# EAGLE design LiPoDisp_td (EAGLE 5.09)
BEST: Farnell 1754066
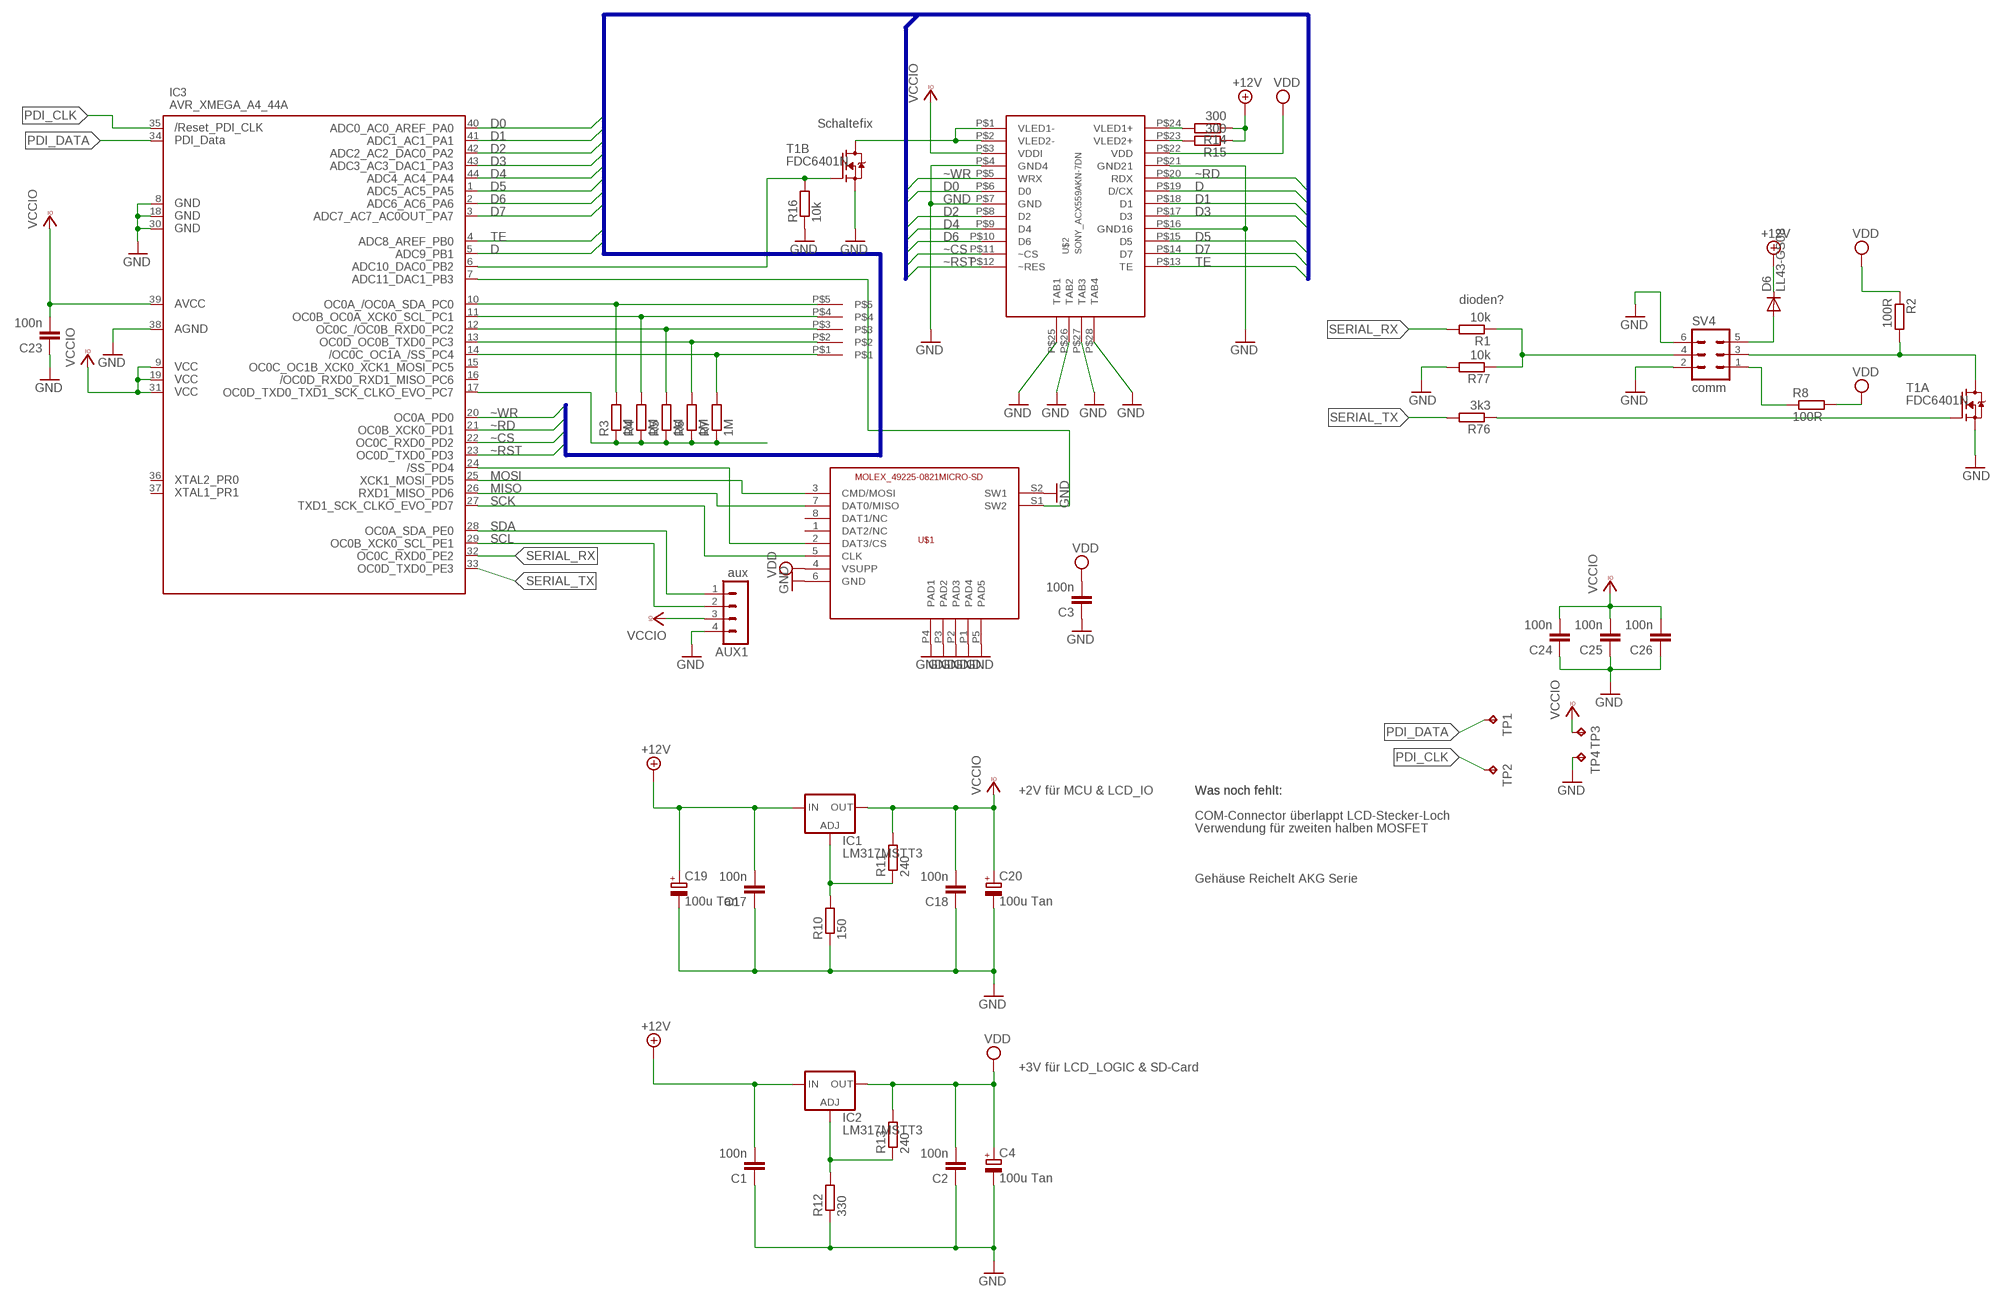
[diagram p0: schematic, sheet 1]

## Parts
AUX1  aux  MA04-1  [MA04-1]
C1  100n  C-EUC0603K  [C0603K]
C2  100n  C-EUC0603K  [C0603K]
C3  100n  C-EUC0603K  [C0603K]
C4  100u Tan  CPOL-EUSMCC  [SMC_C]
C17  100n  C-EUC0603K  [C0603K]
C18  100n  C-EUC0603K  [C0603K]
C19  100u Tan  CPOL-EUSMCC  [SMC_C]
C20  100u Tan  CPOL-EUSMCC  [SMC_C]
C23  100n  C-EUC0603K  [C0603K]
C24  100n  C-EUC0603K  [C0603K]
C25  100n  C-EUC0603K  [C0603K]
C26  100n  C-EUC0603K  [C0603K]
D6  LL43-GS08  DIODE-SOD80C  [SOD80C]
IC1  LM317MSTT3  [SOT223]
IC2  LM317MSTT3  [SOT223]
IC3  AVR_XMEGA_A4_44A  [TQFP44]
P3  PAD5V  [PAD5V]
R1  10k  R-EU_R0603  [R0603]
R2  100R  R-EU_R1206  [R1206]
R3  1M  R-EU_R0603  [R0603]
R4  1M  R-EU_R0603  [R0603]
R5  1M  R-EU_R0603  [R0603]
R6  1M  R-EU_R0603  [R0603]
R7  1M  R-EU_R0603  [R0603]
R8  100R  R-EU_R1206  [R1206]
R10  150  R-EU_R0603  [R0603]
R11  240  R-EU_R0603  [R0603]
R12  330  R-EU_R0603  [R0603]
R13  240  R-EU_R0603  [R0603]
R14  300  R-EU_R0603  [R0603]
R15  300  R-EU_R0603  [R0603]
R16  10k  R-EU_R0603  [R0603]
R76  3k3  R-EU_R0603  [R0603]
R77  10k  R-EU_R0603  [R0603]
SV4  comm  ML6L  [ML6L]
T1  FDC6401N  [SUPERSOT-6]
TP1  TPTP15R  [TP15R]
TP2  TPTP15R  [TP15R]
TP3  TPTP15R  [TP15R]
TP4  TPTP15R  [TP15R]
U$1  MOLEX_49225-0821MICRO-SD  [MOLEX_49225-0821MICRO-SD]
U$2  SONY_ACX559AKN-7DN  [SONY_ACX559AKN-7_A]

## Nets
+12V [Lo-Power]: C1.2 C17.2 C19.+ D6.C IC1.3(IN) IC2.3(IN) R14.1 R15.1
D: IC3.5(PB1) U$2.P$19(D/CX)
D0: IC3.40(PA0) U$2.P$6(D0)
D1: IC3.41(PA1) U$2.P$18(D1)
D2: IC3.42(PA2) U$2.P$8(D2)
D3: IC3.43(PA3) U$2.P$17(D3)
D4: IC3.44(PA4) U$2.P$9(D4)
D5: IC3.1(PA5) U$2.P$15(D5)
D6: IC3.2(PA6) U$2.P$10(D6)
D7: IC3.3(PA7) U$2.P$14(D7)
GND [Lo-Power]: AUX1.4 C1.1 C2.1 C3.1 C4.- C17.1 C18.1 C19.- C20.- C23.1 C24.1 C25.1 C26.1 IC3.8(GND1) IC3.18(GND2) IC3.30(GND3) IC3.38(AGND) R10.1 R12.1 R16.1 R77.2 SV4.2 SV4.6 T1.P$2(B:S) T1.P$5(A:S) TP4.TP U$1.6(GND) U$1.P1(PAD4) U$1.P2(PAD3) U$1.P3(PAD2) U$1.P4(PAD1) U$1.P5(PAD5) U$1.S2(SW1) U$2.P$4(GND4) U$2.P$7(GND) U$2.P$16(GND16) U$2.P$21(GND21) U$2.P$25(TAB1) U$2.P$26(TAB2) U$2.P$27(TAB3) U$2.P$28(TAB4)
MISO: IC3.26(PD6) U$1.7(DAT0/MISO)
MOSI: IC3.25(PD5) U$1.3(CMD/MOSI)
N$1: IC3.7(PB3) U$1.S1(SW2)
N$2 [Lo-Power]: R8.1 SV4.1
N$3: R2.2 SV4.3 T1.P$6(A:D)
N$5: IC3.10(PC0) P3.P$5 R3.2
N$6: IC3.11(PC1) P3.P$4 R4.2
N$7: IC3.12(PC2) P3.P$3 R5.2
N$8: IC3.13(PC3) P3.P$2 R6.2
N$9: IC3.14(PC4) P3.P$1 R7.2
N$10: R76.1 T1.P$1(A:G)
N$13: IC3.17(PC7) R3.1 R4.1 R5.1 R6.1 R7.1
N$14: IC3.24(PD4) U$1.2(DAT3/CS)
N$15: IC1.1(ADJ) R10.2 R11.1
N$16: IC2.1(ADJ) R12.2 R13.1
N$17: T1.P$4(B:D) U$2.P$1(VLED1-) U$2.P$2(VLED2-)
N$18: IC3.6(PB2) R16.2 T1.P$3(B:G)
N$19: R14.2 U$2.P$24(VLED1+)
N$20: R15.2 U$2.P$23(VLED2+)
N$84 [Lo-Power]: D6.A SV4.5
PDI_CLK: IC3.35(RESET) TP2.TP
PDI_DATA: IC3.34(PDI_DATA) TP1.TP
SCK: IC3.27(PD7) U$1.5(CLK)
SCL: AUX1.2 IC3.29(PE1)
SDA: AUX1.1 IC3.28(PE0)
SERIAL_RX: IC3.32(PE2) R1.2
SERIAL_RX_R: R1.1 R77.1 SV4.4
SERIAL_TX: IC3.33(PE3) R76.2
TE: IC3.4(PB0) U$2.P$13(TE)
VCCIO [Lo-Power]: AUX1.3 C18.2 C20.+ C23.2 C24.2 C25.2 C26.2 IC1.4(OUT) IC3.9(VCC1) IC3.19(VCC2) IC3.31(VCC3) IC3.39(AVCC) R11.2 TP3.TP U$2.P$3(VDDI)
VDD [Lo-Power]: C2.2 C3.2 C4.+ IC2.4(OUT) R2.1 R8.2 R13.2 U$1.4(VSUPP) U$2.P$22(VDD)
~CS: IC3.22(PD2) U$2.P$11(~CS)
~RD: IC3.21(PD1) U$2.P$20(RDX)
~RST: IC3.23(PD3) U$2.P$12(~RES)
~WR: IC3.20(PD0) U$2.P$5(WRX)
Unconnected: IC3.15(PC5) IC3.16(PC6) IC3.36(PR0) IC3.37(PR1) U$1.1(DAT2/NC) U$1.8(DAT1/NC)

## Buses
D[0..7],~WR,~RD,~CS,~RST,D,TE

## Notes on the sheet
- Schaltefix
- dioden?
- +2V für MCU & LCD_IO | Was noch fehlt: | Was noch fehlt:
- COM-Connector überlappt LCD-Stecker-Loch
- Verwendung für zweiten halben MOSFET
- Gehäuse Reichelt AKG Serie
- +3V für LCD_LOGIC & SD-Card

## Library data of the parts
AUX1 = Fabian:MA04-1: PIN HEADER
C1-C3 C17 C18 C23-C26 = rcl:C-EU: CAPACITOR, European symbol
C4 C19 C20 = rcl:CPOL-EU: POLARIZED CAPACITOR, European symbol
D6 = diode:DIODE-: DIODE
IC1 IC2 = v-reg:LM317?*: 500 mA Adjustable Output Positive Voltage Regulator Source: http://www.onsemi.co.jp .. LM317M-D.PDF
IC3 = xmega:AVR_XMEGA_A4_: Device for Atmel AVR XMEGA A4 Series
P3 = Fabian:PAD5
R1-R8 R10-R16 R76 R77 = rcl:R-EU_: RESISTOR, European symbol
SV4 = con-harting-ml:ML6: HARTING
T1 = Fabian:FDC6401N: dual n mosfet; BEST: Farnell 1467966
TP1-TP4 = testpad:TP: Test pad
U$1 = Fabian:MOLEX_49225-0821MICRO-SD: MOLEX_49225-0821MICRO-SD
U$2 = Fabian:SONY_ACX559AKN-7: SONY ACX559AKN-7 full Color display matching connector JST-JAN 24R-JANK-GSAN-TF

## Net classes
1 Hi-Power: width 0.2 mm
2 Lo-Power: width 0.2 mm

## Board
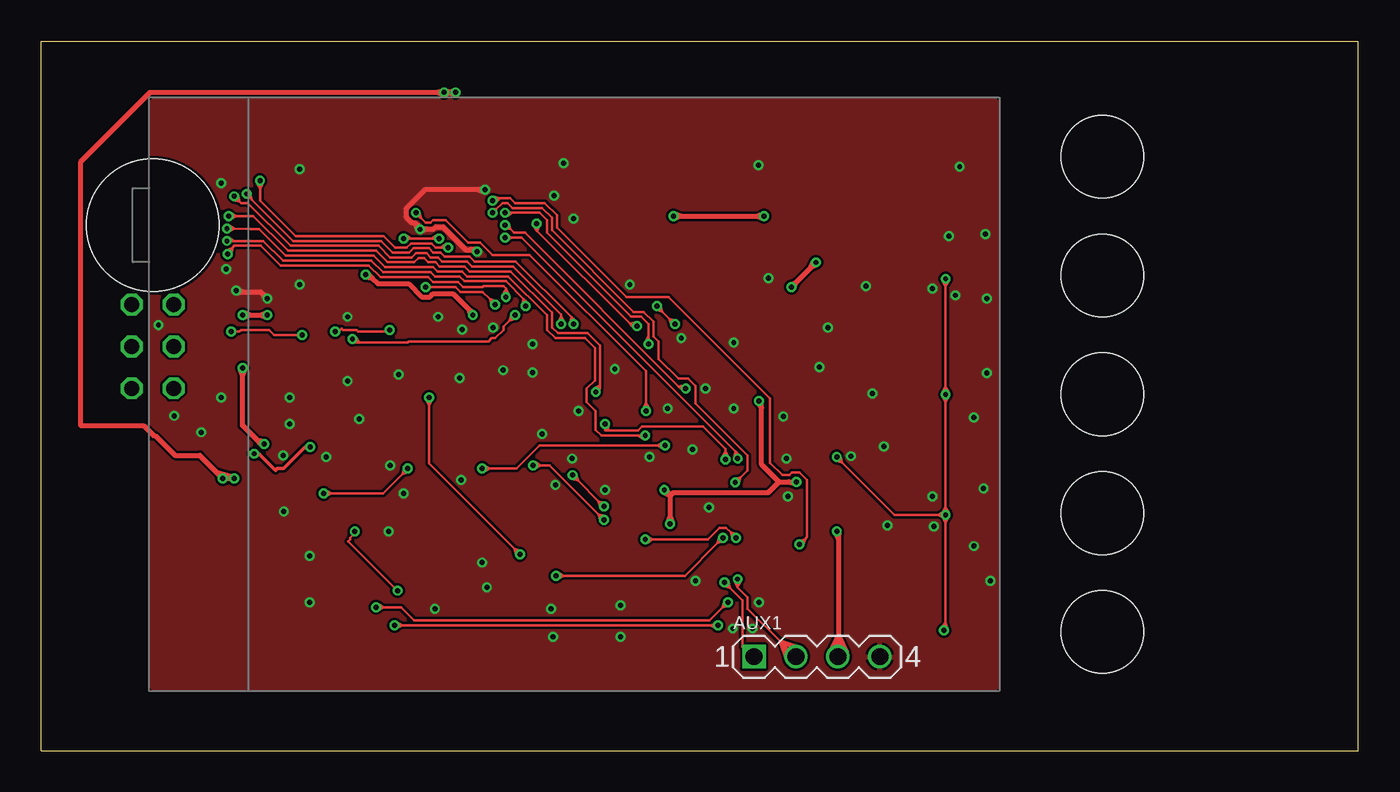
[diagram p1: board, top side]
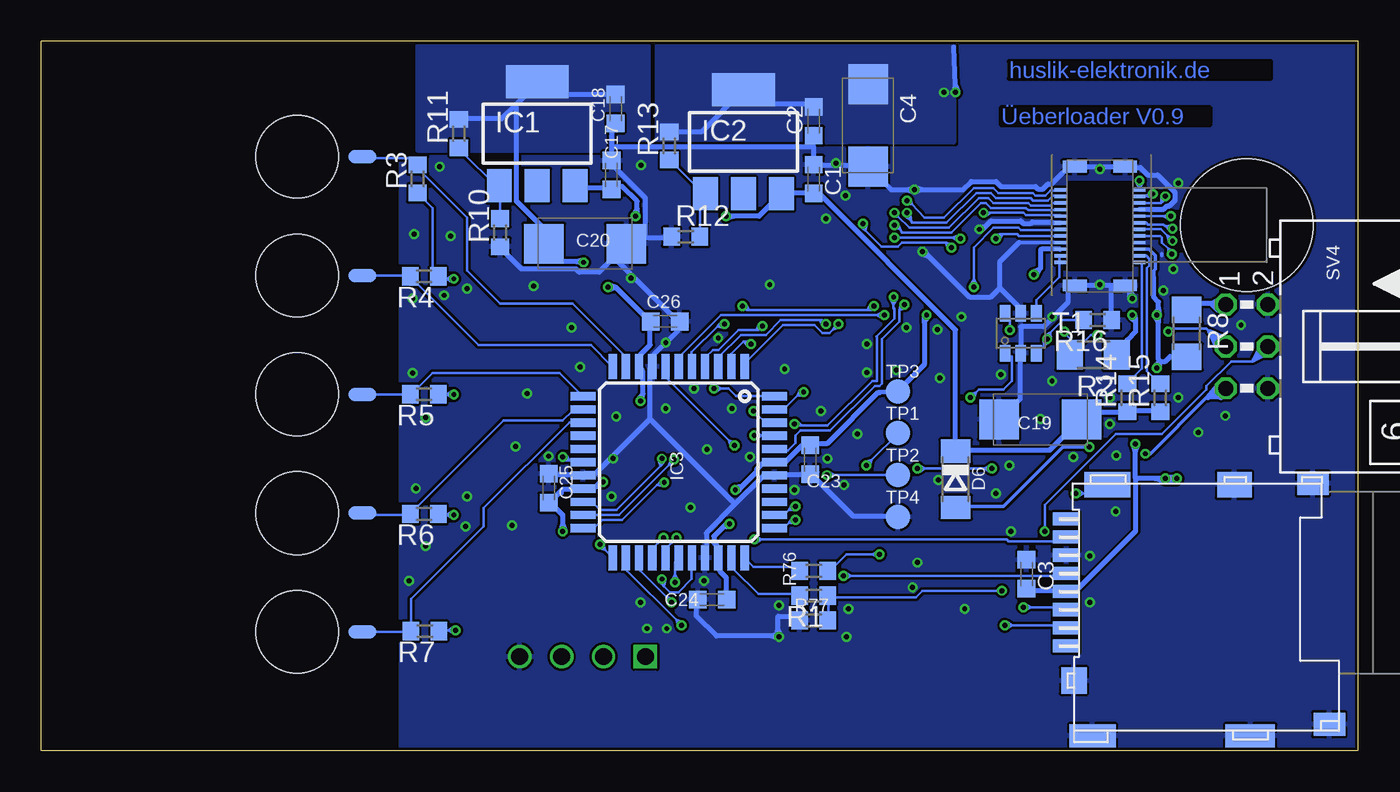
[diagram p2: board, bottom side, seen from below]

Size 79.8 x 43 mm. Coordinates in mm from the lower left corner, seen from the top.
Outline: 0,0 79.8,0 79.8,43 0,43 0,0
Copper layers (1*16): Top 0.035mm / dielectric 1.5mm / Bottom 0.035mm
Design rules "Fischer-LP *": minimum track width 0.15mm, minimum drill 0.3mm, track to track 0.15mm, track to pad 0.15mm, pad to pad 0.15mm, via to via 0.15mm, smd to smd 0mil, copper to edge 0.2mm, drill to drill 0.3mm, minimum pad ring 0.2mm, minimum via ring 0.15mm, stop-mask expansion 0.1mm, vias tented up to drill 0.5mm, thermal gap 0.15mm

### Footprints (pad centres in the part's own frame; a part is rotated, then mirrored left to right if it is on the bottom)
MA04-1 = drill 1.016 square: 1 -3.81,0 | drill 1.016 round: 2 -1.27,0; 3 1.27,0; 4 3.81,0
C0603K = smd 1.05 x 1.08: 1 -0.875,0; 2 0.875,0
SMC_C = smd 2.4 x 2.4: + -2.5,0; - 2.5,0
SOD80C = smd 1.4 x 1.8: A 1.7,0; C -1.7,0
SOT223 = smd 1.5 x 2: 1 -2.3,-3.15; 2 0,-3.15; 3 2.3,-3.15 | smd 3.8 x 2: 4 0,3.15
TQFP44 = smd 1.5 x 0.5: 1 -5.8,4; 2 -5.8,3.2; 3 -5.8,2.4; 4 -5.8,1.6; 5 -5.8,0.8; 6 -5.8,0; 7 -5.8,-0.8; 8 -5.8,-1.6; 9 -5.8,-2.4; 10 -5.8,-3.2; 11 -5.8,-4; 23 5.8,-4; 24 5.8,-3.2; 25 5.8,-2.4; 26 5.8,-1.6; 27 5.8,-0.8; 28 5.8,0; 29 5.8,0.8; 30 5.8,1.6; 31 5.8,2.4; 32 5.8,3.2; 33 5.8,4 | smd 0.5 x 1.5: 12 -4,-5.8; 13 -3.2,-5.8; 14 -2.4,-5.8; 15 -1.6,-5.8; 16 -0.8,-5.8; 17 0,-5.8; 18 0.8,-5.8; 19 1.6,-5.8; 20 2.4,-5.8; 21 3.2,-5.8; 22 4,-5.8; 34 4,5.8; 35 3.2,5.8; 36 2.4,5.8; 37 1.6,5.8; 38 0.8,5.8; 39 0,5.8; 40 -0.8,5.8; 41 -1.6,5.8; 42 -2.4,5.8; 43 -3.2,5.8; 44 -4,5.8
PAD5V = smd 0.813 x 1.676: P$1 3.6,-3.95; P$2 10.8,-3.95; P$3 18,-3.95; P$4 25.2,-3.95; P$5 32.4,-3.95 | hole 5: 3.6,0; 10.8,0; 18,0; 25.2,0; 32.4,0
R0603 = smd 1 x 1.1: 1 -0.85,0; 2 0.85,0
R1206 = smd 1.6 x 1.803: 1 -1.422,0; 2 1.422,0
ML6L = drill 0.914 octagon: 1 -2.54,-1.27; 2 -2.54,1.27; 3 0,-1.27; 4 0,1.27; 5 2.54,-1.27; 6 2.54,1.27
SUPERSOT-6 = smd 0.65 x 1: P$1 -0.95,-1.2; P$2 0,-1.2; P$3 0.95,-1.2; P$4 0.95,1.2; P$5 0,1.2; P$6 -0.95,1.2
TP15R = smd 1.5 x 1.5: TP 0,0
MOLEX_49225-0821MICRO-SD = smd 0.8 x 1.6: 1 -10.55,16.6; 2 -9.45,16.6; 3 -8.35,16.6; 4 -7.25,16.6; 5 -6.15,16.6; 6 -5.05,16.6; 7 -3.95,16.6; 8 -2.85,16.6 | smd 1.4 x 1.9: P1 -0.7,1.65; P2 -15.3,0.65 | smd 1.4 x 3: P3 -16,5.45 | smd 1.4 x 2.8: P4 -16,15 | smd 1.6 x 1.55: P5 -12.65,16.125 | smd 1.55 x 2.8: S1 -0.775,14.1 | smd 1.55 x 2.1: S2 -0.775,6.4
SONY_ACX559AKN-7_A = smd 0.2 x 0.7: P$1 0,0; P$2 0.4,0; P$3 0.8,0; P$4 1.2,0; P$5 1.6,0; P$6 2,0; P$7 2.4,0; P$8 2.8,0; P$9 3.2,0; P$10 3.6,0; P$11 4,0; P$12 4.4,0; P$13 4.4,-4.8; P$14 4,-4.8; P$15 3.6,-4.8; P$16 3.2,-4.8; P$17 2.8,-4.8; P$18 2.4,-4.8; P$19 2,-4.8; P$20 1.6,-4.8; P$21 1.2,-4.8; P$22 0.8,-4.8; P$23 0.4,-4.8; P$24 0,-4.8 | smd 0.7 x 1.45: P$25 5.8,-0.875; P$26 5.8,-3.925; P$27 -1.4,-3.925; P$28 -1.4,-0.875 | hole 8: 2.25,-11.3

### Placement (x,y rotation side)
AUX1  47,5.7 0 top
C1  33,34.65 270 bottom
C2  33,38.15 90 bottom
C3  20.1,10.7 270 bottom
C4  29.7,37.9 270 bottom
C17  45.25,34.9 270 bottom
C18  45,38.9 90 bottom
C19  19.27,20.07 180 bottom
C20  46.85,30.73 0 bottom
C23  33.21,17.64 90 bottom
C24  39.15,9.16 0 bottom
C25  49.05,15.91 270 bottom
C26  41.99,26.02 180 bottom
D6  24.4,16.45 270 bottom
IC1  49.75,37.4 0 bottom
IC2  37.25,36.9 0 bottom
IC3  41.18,17.48 270 bottom
P3  64.3,3.6 90 bottom
R1  33,9.4 180 bottom
R2  16.05,24 180 bottom
R3  57,34.65 90 bottom
R4  56.6,28.75 180 bottom
R5  56.6,21.6 180 bottom
R6  56.6,14.35 180 bottom
R7  56.55,7.25 180 bottom
R8  10.4,25.3 270 bottom
R10  52,31.4 90 bottom
R11  54.5,37.4 90 bottom
R12  40.75,31.15 0 bottom
R13  41.75,36.65 90 bottom
R14  14,21.4 90 bottom
R15  12,21.4 90 bottom
R16  15.8,26.1 180 bottom
R76  33,10.9 180 bottom
R77  33,7.9 180 bottom
SV4  6.75,24.5 270 bottom
T1  20.45,25.3 0 bottom
TP1  27.89,19.25 0 bottom
TP2  27.89,16.7 0 bottom
TP3  27.89,21.79 0 bottom
TP4  27.89,14.16 0 bottom
U$1  1.1,16.9 90 bottom
U$2  18.05,29.6 90 bottom

### Tracks (layer width: path | path; a pad name or v marks a point on that pad's centre or on a via)
+12V  (via drill 0.3)
  Top 0.3: v38.3,32.4 38.75,32.4 | 38.75,32.4 43.35,32.4 | 43.35,32.4 v43.8,32.4 | 43.35,32.4 43.75,32.26 v43.8,32.4 | 43.35,32.4 43.75,32.54 v43.8,32.4 | 38.75,32.4 38.35,32.54 v38.3,32.4 | 38.75,32.4 38.35,32.26 v38.3,32.4
  Bottom 0.3: IC1.3 47.3,34.1 45.3,34.1 C17.2 45.2,34.2 44.6,34.2 43.7,33.3 43.7,32.84 | R15.1 12,20.6 14,20.6 R14.1 14.1,20.5 16.3,20.5 16.7,20.1 C19.+ 16.9,20 18.7,18.2 24.4,18.2 D6.C 24.4,25.5 32.6,33.7 32.9,33.7 C1.2 33,33.8 34.9,33.8 IC2.3 36.3,32.4 37.85,32.4 | v43.8,32.4 43.7,32.5 43.7,32.84 | 37.85,32.4 v38.3,32.4 | 43.7,32.84 43.65,32.42 v43.8,32.4 | 43.7,32.84 43.93,32.48 v43.8,32.4 | 37.85,32.4 38.25,32.26 v38.3,32.4 | 37.85,32.4 38.25,32.44 v38.3,32.4
D  (via drill 0.3)
  Top 0.15: v11.25,30.9 11.2,30.9 | v11.25,30.9 11.7,30.9 | 11.7,30.9 13.45,30.9 14.65,29.7 20,29.7 20.7,29 23.6,29 23.85,28.75 25.35,28.75 25.65,28.45 28.15,28.45 29.22,27.38 | 29.22,27.38 29.35,27.25 v29.35,26.95 | v37.3,26.95 37.62,26.63 | 37.62,26.63 38.08,26.17 | 38.08,26.17 v38.4,25.85 | 11.7,30.9 11.36,31.09 v11.25,30.9 | 11.7,30.9 11.26,30.91 v11.25,30.9 | 29.22,27.38 29.13,27 v29.35,26.95 | 29.22,27.38 29.5,27.11 v29.35,26.95 | 37.62,26.63 37.52,27.01 v37.3,26.95 | 37.62,26.63 37.24,26.73 v37.3,26.95 | 38.08,26.17 38.18,25.79 v38.4,25.85 | 38.08,26.17 38.46,26.07 v38.4,25.85
  Bottom 0.15: v11.25,30.9 11.57,31.22 | 11.57,31.22 11.95,31.6 U$2.P$19 | v29.35,26.95 29.35,26.75 29.4,26.7 29.72,26.7 | 29.72,26.7 36.93,26.7 | 36.93,26.7 37.05,26.7 v37.3,26.95 | v38.4,25.85 38.7,25.85 38.83,25.72 | 38.83,25.72 40.4,24.15 40.4,23.3 IC3.5 | 11.57,31.22 11.19,31.02 v11.25,30.9 | 11.57,31.22 11.47,30.84 v11.25,30.9 | 29.72,26.7 29.55,27.05 v29.35,26.95 | 29.72,26.7 29.34,26.73 v29.35,26.95 | 36.93,26.7 37.31,26.73 v37.3,26.95 | 36.93,26.7 37.1,27.05 v37.3,26.95 | 38.83,25.72 38.56,26 v38.4,25.85 | 38.83,25.72 38.45,25.63 v38.4,25.85
D0  (via drill 0.3)
  Top 0.15: v23.3,28.1 23.45,28.25 23.6,28.1 23.65,28.1 | 23.65,28.1 25.1,28.1 25.4,27.8 26.75,27.8 27.18,27.37 | 27.18,27.37 v27.5,27.05 | 23.65,28.1 23.41,28.2 v23.3,28.1 | 23.65,28.1 23.41,28 v23.3,28.1 | 27.18,27.37 27.28,26.99 v27.5,27.05 | 27.18,27.37 27.56,27.27 v27.5,27.05
  Bottom 0.15: U$2.P$6 18.05,31.55 20.45,31.55 20.6,31.7 22.1,31.7 23.3,30.5 23.3,28.55 | 23.3,28.55 v23.3,28.1 | v27.5,27.05 27.8,26.75 27.8,26.71 | 27.8,26.71 27.8,26 28.85,24.95 28.85,22.25 29,22.1 29.3,22.1 32,19.4 33.8,19.4 34.1,19.1 34.1,18.65 34.55,18.2 35.3,18.2 IC3.40 | 23.3,28.55 23.11,28.21 v23.3,28.1 | 23.3,28.55 23.5,28.21 v23.3,28.1 | 27.8,26.71 27.72,27.1 v27.5,27.05 | 27.8,26.71 27.43,26.84 v27.5,27.05
D1  (via drill 0.3)
  Top 0.15: 11.7,31.64 11.35,31.65 v11.25,31.65 | 11.7,31.64 12.7,31.6 13.2,31.6 14.8,30 20.15,30 20.85,29.3 23.75,29.3 24,29.05 25.5,29.05 25.8,28.75 28.3,28.75 30.65,26.4 30.65,25.5 31.15,25 32.95,25 33.55,24.4 33.55,22.45 33.05,21.95 33.05,21.15 33.6,20.6 33.6,19.45 33.95,19.1 36.15,19.1 | 36.15,19.1 v36.6,19.1 | 11.7,31.64 11.37,31.84 v11.25,31.65 | 11.7,31.64 11.36,31.45 v11.25,31.65 | 36.15,19.1 36.49,18.91 v36.6,19.1 | 36.15,19.1 36.49,19.09 v36.6,19.1
  Bottom 0.15: v11.25,31.65 11.55,31.65 11.68,31.78 | 11.68,31.78 11.8,31.9 12.75,31.9 12.85,32 U$2.P$18 | v36.6,19.1 36.15,19.1 | 36.15,19.1 35.4,19.1 IC3.41 | 11.68,31.78 11.3,31.87 v11.25,31.65 | 11.68,31.78 11.41,31.5 v11.25,31.65 | 36.15,19.1 36.49,18.91 v36.6,19.1 | 36.15,19.1 36.49,19.3 v36.6,19.1
D2  (via drill 0.3)
  Top 0.15: v22.7,32.6 23.02,32.28 | 23.02,32.28 23.3,32 23.6,32 23.75,32.15 24.5,32.15 25.85,30.8 26.6,30.8 27.35,30.05 29.6,30.05 36.65,23 36.65,21.05 | 36.65,21.05 v36.65,20.6 | 23.02,32.28 22.92,32.66 v22.7,32.6 | 23.02,32.28 22.74,32.48 v22.7,32.6 | 36.65,21.05 36.45,20.71 v36.65,20.6 | 36.65,21.05 36.84,20.71 v36.65,20.6
  Bottom 0.15: U$2.P$8 18.05,32.45 20.15,32.45 20.3,32.6 22.25,32.6 | 22.25,32.6 v22.7,32.6 | v36.65,20.6 36.33,20.28 | 36.33,20.28 36.05,20 35.45,20 IC3.42 | 22.25,32.6 22.59,32.41 v22.7,32.6 | 22.25,32.6 22.69,32.59 v22.7,32.6 | 36.33,20.28 36.71,20.38 v36.65,20.6 | 36.33,20.28 36.43,20.66 v36.65,20.6
D3  (via drill 0.3)
  Top 0.15: 33.85,22.12 33.85,24.55 33.1,25.3 31.3,25.3 30.95,25.65 30.95,26.55 28.45,29.05 25.95,29.05 25.65,29.35 24.15,29.35 23.9,29.6 23.45,29.6 23.2,29.85 22.85,29.85 22.6,29.6 21,29.6 20.3,30.3 14.95,30.3 12.85,32.4 11.8,32.4 | 33.85,22.12 33.85,22 v33.6,21.75 | v11.35,32.4 11.8,32.4 | 33.85,22.12 33.5,21.95 v33.6,21.75 | 33.85,22.12 33.83,21.73 v33.6,21.75 | 11.8,32.4 11.46,32.59 v11.35,32.4 | 11.8,32.4 11.46,32.2 v11.35,32.4
  Bottom 0.15: v33.6,21.75 33.75,21.75 33.98,21.52 | 33.98,21.52 34.8,20.7 35.35,20.7 IC3.43 | v11.35,32.4 11.8,32.4 | 11.8,32.4 U$2.P$17 | 33.98,21.52 33.8,21.86 v33.6,21.75 | 33.98,21.52 33.59,21.52 v33.6,21.75 | 11.8,32.4 11.46,32.49 v11.35,32.4 | 11.8,32.4 11.46,32.2 v11.35,32.4
D4  (via drill 0.3)
  Top 0.15: v28.1,31.85 28.42,31.63 | 28.42,31.63 28.65,31.4 29.3,31.4 38.62,22.08 | 38.62,22.08 38.75,21.95 v39.05,21.95 | 28.42,31.63 28.32,31.91 v28.1,31.85 | 28.42,31.63 28.04,31.63 v28.1,31.85 | 38.62,22.08 38.89,21.8 v39.05,21.95 | 38.62,22.08 39,22.17 v39.05,21.95
  Bottom 0.15: U$2.P$9 18.05,32.75 20,32.75 20.15,32.9 22.25,32.9 22.55,33.2 22.85,33.2 24.65,31.4 27.65,31.4 27.78,31.63 | 27.78,31.63 v28.1,31.85 | v39.05,21.95 38.6,21.95 | 38.6,21.95 38.15,21.95 37.7,21.5 35.45,21.5 IC3.44 | 27.78,31.63 28.16,31.63 v28.1,31.85 | 27.78,31.63 27.88,31.91 v28.1,31.85 | 38.6,21.95 38.94,21.75 v39.05,21.95 | 38.6,21.95 38.94,22.14 v39.05,21.95
D5  (via drill 0.3)
  Top 0.15: 31.5,26.3 31.5,26.45 28.6,29.35 26.1,29.35 25.8,29.65 24.3,29.65 24.05,29.9 23.6,29.9 23.35,30.15 22.7,30.15 22.45,29.9 21.15,29.9 20.45,30.6 15.1,30.6 12.5,33.2 12.1,33.2 12.02,33.28 | 31.5,26.3 v31.5,25.85 | v11.7,33.6 12.02,33.28 | 31.5,26.3 31.3,25.96 v31.5,25.85 | 31.5,26.3 31.7,25.96 v31.5,25.85 | 12.02,33.28 11.92,33.66 v11.7,33.6 | 12.02,33.28 11.64,33.38 v11.7,33.6
  Bottom 0.15: v31.5,25.85 31.82,25.53 | 31.82,25.53 32.05,25.3 32.45,25.3 32.95,25.8 34.85,25.8 37.15,23.5 37.15,23.3 IC3.1 | v11.7,33.6 11.7,33.45 11.93,33.22 | 11.93,33.22 11.95,33.2 U$2.P$15 | 31.82,25.53 31.62,25.81 v31.5,25.85 | 31.82,25.53 31.44,25.63 v31.5,25.85 | 11.93,33.22 11.93,33.6 v11.7,33.6 | 11.93,33.22 11.69,33.4 v11.7,33.6
D6  (via drill 0.3)
  Top 0.15: v28.1,32.6 28.55,32.6 | 28.55,32.6 30.2,32.6 30.65,32.15 30.65,31.4 35.75,26.3 36.35,26.3 36.8,25.85 36.8,25.1 | 36.8,25.1 v36.8,24.65 | 28.55,32.6 28.21,32.59 v28.1,32.6 | 28.55,32.6 28.21,32.41 v28.1,32.6 | 36.8,25.1 36.6,24.76 v36.8,24.65 | 36.8,25.1 36.8,24.76 v36.8,24.65
  Bottom 0.15: U$2.P$10 18.5,33.2 18.65,33.05 19.85,33.05 20,33.2 22.1,33.2 22.4,33.5 23,33.5 24.8,31.7 27.2,31.7 27.88,32.38 | 27.88,32.38 v28.1,32.6 | v36.8,24.65 36.95,24.8 37.22,24.8 | 37.22,24.8 37.25,24.8 38,24.05 38,23.3 IC3.2 | 27.88,32.38 28.16,32.38 v28.1,32.6 | 27.88,32.38 27.88,32.66 v28.1,32.6 | 37.22,24.8 36.84,24.87 v36.8,24.65 | 37.22,24.8 36.97,24.5 v36.8,24.65
D7  (via drill 0.3)
  Top 0.15: v32.25,25.85 32.25,26.15 32.12,26.28 | 32.12,26.28 28.75,29.65 26.25,29.65 25.95,29.95 24.45,29.95 24.2,30.2 23.75,30.2 23.5,30.45 22.55,30.45 22.3,30.2 21.3,30.2 20.6,30.9 15.25,30.9 12.74,33.41 | 12.74,33.41 12.45,33.7 v12.45,33.75 | 32.12,26.28 32.03,25.9 v32.25,25.85 | 32.12,26.28 32.4,26.01 v32.25,25.85 | 12.74,33.41 12.67,33.79 v12.45,33.75 | 12.74,33.41 12.47,33.64 v12.45,33.75
  Bottom 0.15: v32.25,25.85 32.5,26.1 32.62,26.1 | 32.62,26.1 35,26.1 35.9,25.2 37.4,25.2 38.75,23.85 38.75,23.3 IC3.3 | v12.45,33.75 12.7,33.75 12.85,33.6 12.87,33.6 | 12.87,33.6 U$2.P$14 | 32.62,26.1 32.23,26.07 v32.25,25.85 | 32.62,26.1 32.45,25.75 v32.25,25.85 | 12.87,33.6 12.62,33.8 v12.45,33.75 | 12.87,33.6 12.49,33.53 v12.45,33.75
GND  (via drill 0.3)
  Top 0.3: v22.95,31.6 23.4,31.6 | 23.4,31.6 23.75,31.6 23.9,31.75 24.35,31.75 25.75,30.35 25.95,30.35 26.07,30.36 | 26.07,30.36 26,30.4 26.25,30.4 v26.4,30.25 | 22.65,32 22.45,32 22.1,32.35 22.1,32.85 23.25,34 26.45,34 | 22.65,32 22.64,31.9 | 22.65,32 23,31.75 23,31.7 v22.95,31.6 | v26.9,34 26.45,34 | 11.8,27.8 11.7,27.8 | 11.8,27.8 12.24,27.8 | 12.24,27.8 13.3,27.8 13.38,27.72 | 13.38,27.72 v13.7,27.4 | v11.8,27.9 11.8,27.8 | 23.4,31.6 22.9,31.64 v22.95,31.6 | 23.4,31.6 23,31.46 v22.95,31.6 | 22.64,31.9 22.8,31.58 v22.95,31.6 | 22.64,31.9 22.85,31.71 v22.95,31.6 | 26.07,30.36 26.42,30.13 v26.4,30.25 | 26.07,30.36 26.39,30.4 v26.4,30.25 | 26.45,34 26.85,33.86 v26.9,34 | 26.45,34 26.85,34.14 v26.9,34 | 13.38,27.72 13.56,27.34 v13.7,27.4 | 13.38,27.72 13.77,27.54 v13.7,27.4 | 12.24,27.8 11.88,28.03 v11.8,27.9 | 12.24,27.8 11.82,27.75 v11.8,27.9
  Bottom 0.2: 20.55,30.8 U$2.P$4 | 11.9,30.13 11.9,30.1 11.9,30.02
  Bottom 0.3: 33,36.6 C1.1 32.9,35.5 29.8,35.5 C4.- 28.3,34 27.35,34 | 33,36.6 C2.1 | 15,28.2 U$2.P$28 | 15,28.2 U$2.P$27 14.1,28.1 13.83,27.83 | U$2.P$28 17.6,28.2 | 42.9,20.1 46.2,16.8 46.9,16.8 IC3.18 47.1,16.7 48.95,16.7 49,16.75 C25.1 | 42.9,20.1 42.9,23.2 IC3.8 42.7,23.3 42.7,24 41.2,25.5 41.2,26 C26.1 41.3,26.1 45,29.8 C20.- | 45.2,36.6 45.2,37.8 45,38 C18.1 | 45.2,36.6 45.2,35.8 C17.1 45.1,35.7 45.1,35.4 43.2,33.5 43.2,31.2 C20.- | R12.1 41.6,31.1 44,31.1 44.3,30.8 C20.- | R10.1 52,30.5 50.7,29.2 47.4,29.2 47.2,29 46,29 44.4,30.6 C20.- | TP4.TP 27.9,14.2 30.6,14.2 33.1,16.7 C23.1 33.3,16.7 35.3,16.7 IC3.38 35.5,16.6 36.1,16.6 37.75,14.95 | 37.75,14.95 39.5,13.2 39.5,11.8 IC3.30 | 37.75,14.95 42.9,20.1 | 45.2,36.6 33,36.6 | C19.- 21.7,20.1 20.5,21.3 20.5,24.1 T1.P$2 20.45,25.7 19.05,25.7 17.6,27.15 17.6,28.1 U$2.P$28 | R77.2 34.1,8.15 35.15,8.15 35.15,7.35 | 35.15,7.35 35.15,7.1 35.3,6.95 35.55,6.95 | 35.55,6.95 38.9,6.95 40.1,8.15 40.1,9.05 C24.1 | R16.1 15,25.7 15,28.2 | 21.7,28.05 20.55,26.9 20.55,26.6 | 21.7,28.05 21.7,29.65 20.55,30.8 | U$2.P$16 11.8,32.8 11.6,33 11.45,33 11.1,33.35 11.1,33.85 12.15,34.9 12.75,34.9 13.2,35.35 14,35.35 U$2.P$26 U$2.P$25 17.3,35.35 17.6,35.35 18.6,34.35 18.8,34.35 19.1,34.05 19.4,34.05 19.55,34.2 21.65,34.2 21.95,34.5 23.45,34.5 23.95,34 26.45,34 | 22.55,31.8 22.75,31.6 v22.95,31.6 | 22.55,31.8 22.25,32.1 20.45,32.1 20.3,31.95 19.85,31.95 19.75,32.05 18.6,32.05 18.55,32 U$2.P$7 | v26.4,30.25 26.3,30.25 26.04,29.99 | 26.04,29.99 23.55,27.5 22.25,27.5 21.7,28.05 | 27.35,34 v26.9,34 | v26.9,34 26.45,34 | v13.7,27.4 13.7,27.7 13.83,27.83
  Bottom 0.3: 22.55,31.8 22.84,31.5 v22.95,31.6 | 22.55,31.8 22.97,31.75 v22.95,31.6 | 26.04,29.99 26.44,30.11 v26.4,30.25 | 26.04,29.99 26.28,30.34 v26.4,30.25 | 27.35,34 26.95,34.14 v26.9,34 | 27.35,34 26.95,33.86 v26.9,34 | 26.45,34 26.85,33.86 v26.9,34 | 26.45,34 26.85,34.14 v26.9,34 | 13.83,27.83 13.58,27.49 v13.7,27.4 | 13.83,27.83 13.85,27.41 v13.7,27.4 | 35.15,7.35 34.97,6.96 v35.1,6.9 | 35.15,7.35 35.25,6.93 v35.1,6.9 | 35.55,6.95 35.13,7.05 v35.1,6.9 | 35.55,6.95 35.16,6.76 v35.1,6.9
  other vias: 21.05,13.3 8.05,20.3 18.55,22.4 18.55,26.3 24.05,26.3 25.49,25.53 27.38,25.65 27.98,23.06 29.78,24.64 29.77,22.91 34.75,23.14 37.96,20.75 38.78,25.02 41.96,20.75 39.46,18.25 44.96,20.25 41.96,24.75 40.46,14.75 40.26,21.96 21.95,15.6 21.15,17.3 19.25,20.1 21.65,22.8 25.35,22.6 47.16,23.25 47.66,25.65 49.96,28.15 50.36,21.65 51.06,18.45 51.26,13.65 49.06,17.85 14.65,17.9 15.05,19.8 15.05,21.4 17.25,17.8 16.25,11.8 16.25,9 23.85,8.6 39.65,10.3 36.85,17.8 34.15,15.8 32.15,17.7 31.15,16.1 30.35,19.2 32.55,20.6 55.65,35.4 43.45,35.5 31.65,35.6 10.9,21.4 9.7,19.3 14.7,14.5 27,9.9 26.7,11.4 30.9,8.6 35.1,8.8 31,6.9 43.1,7.4 43.5,9 41.9,7.4 54,15.4 54.1,13.6 56.5,12.4 56.5,20.2 57.1,15.9 57.5,10.3 57.3,22.9 57.3,27.4 55.4,27.6 57.2,31.3 55,31.2 54,28 44.06,28.65 32.26,32.25 35.66,28.25 31.06,33.65 15.66,35.25 15.66,28.25 11.2,29.2 7.1,25.8 10.9,34.4 25.45,16.4 45.25,15.4 45.15,17.7
  pour Bottom (rank 2): 0.2,42.8 58,42.8 58,0.2 0.2,0.2
  pour Top: 6.76,39.39 57.84,39.39 57.84,3.81 6.76,3.81
MISO  (via drill 0.3)
  Top 0.15: v36.6,12.8 37.05,12.8 | 37.05,12.8 40.4,12.8 41.1,13.5 41.5,13.5 41.78,13.22 | 41.78,13.22 v42.1,12.9 | 37.05,12.8 36.71,12.99 v36.6,12.8 | 37.05,12.8 36.71,12.61 v36.6,12.8 | 41.78,13.22 41.88,12.84 v42.1,12.9 | 41.78,13.22 42.16,13.12 v42.1,12.9
  Bottom 0.15: U$1.7 17.7,12.8 17.8,12.7 21.2,12.7 21.3,12.8 36.15,12.8 | 36.15,12.8 v36.6,12.8 | v42.1,12.9 42.42,12.58 | 42.42,12.58 42.7,12.3 42.7,11.7 IC3.26 | 36.15,12.8 36.49,12.61 v36.6,12.8 | 36.15,12.8 36.49,12.99 v36.6,12.8 | 42.42,12.58 42.32,12.96 v42.1,12.9 | 42.42,12.58 42.14,12.88 v42.1,12.9
MOSI  (via drill 0.3)
  Top 0.15: v20.3,8.7 20.75,8.7 | 20.75,8.7 21.8,8.7 22.6,7.9 40.5,7.9 41.28,8.68 | 41.28,8.68 v41.6,9 | 20.75,8.7 20.41,8.89 v20.3,8.7 | 20.75,8.7 20.41,8.51 v20.3,8.7 | 41.28,8.68 41.66,8.78 v41.6,9 | 41.28,8.68 41.38,9.06 v41.6,9
  Bottom 0.15: U$1.3 17.7,8.5 17.9,8.7 19.85,8.7 | 19.85,8.7 v20.3,8.7 | v41.6,9 41.92,9.32 | 41.92,9.32 43.5,10.9 43.5,11.6 IC3.25 | 19.85,8.7 20.19,8.51 v20.3,8.7 | 19.85,8.7 20.19,8.89 v20.3,8.7 | 41.92,9.32 41.54,9.22 v41.6,9 | 41.92,9.32 41.82,8.94 v41.6,9
N$1  (via drill 0.3)
  Top 0.15: v17.1,15.6 17.55,15.6 | 17.55,15.6 20.7,15.6 21.88,16.78 | 21.88,16.78 v22.2,17.1 | v26.7,17.1 27.15,17.1 | 27.15,17.1 28.8,17.1 30.2,18.5 37.35,18.5 | 37.35,18.5 v37.8,18.5 | 17.55,15.6 17.21,15.79 v17.1,15.6 | 17.55,15.6 17.21,15.4 v17.1,15.6 | 21.88,16.78 22.26,16.88 v22.2,17.1 | 21.88,16.78 21.98,17.16 v22.2,17.1 | 27.15,17.1 26.81,17.3 v26.7,17.1 | 27.15,17.1 26.81,16.91 v26.7,17.1 | 37.35,18.5 37.69,18.3 v37.8,18.5 | 37.35,18.5 37.69,18.7 v37.8,18.5
  Bottom 0.15: 16.65,15.6 15.6,15.6 15.2,16 U$1.S1 | 16.65,15.6 v17.1,15.6 | v22.2,17.1 22.65,17.1 | 22.65,17.1 26.25,17.1 | 26.25,17.1 v26.7,17.1 | v37.8,18.5 38.12,18.82 | 38.12,18.82 41.9,22.6 41.9,23.2 IC3.7 | 16.65,15.6 16.99,15.4 v17.1,15.6 | 16.65,15.6 16.99,15.79 v17.1,15.6 | 22.65,17.1 22.31,17.3 v22.2,17.1 | 22.65,17.1 22.31,16.91 v22.2,17.1 | 26.25,17.1 26.59,16.91 v26.7,17.1 | 26.25,17.1 26.59,17.3 v26.7,17.1 | 38.12,18.82 37.74,18.72 v37.8,18.5 | 38.12,18.82 38.02,18.44 v37.8,18.5
N$2
  Bottom 0.3: SV4.1 8.1,27.1 8.9,27.1 | 8.9,27.1 10.1,27.1 10.4,26.8 R8.1 | 8.9,27.1 8.5,26.7 | 8.9,27.1 8.5,27.3
N$3  (via drill 0.3)
  Top 0.15: v11.5,25.4 12,25.4 12.1,25.5 13.8,25.5 14.1,25.2 v15.8,25.2 | v17.8,25.4 17.9,25.4 18,25.5 18.1,25.5 18.2,25.6 18.3,25.5 19.1,25.5 19.2,25.4 21,25.4 v21.1,25.5
  Bottom 0.15: SV4.3 8.1,24.5 9,25.4 9.2,25.6 11.6,25.6 11.6,25.5 v11.5,25.4 | v15.8,25.2 16.2,25.2 17.4,24 R2.2 17,24.5 17.8,25.3 v17.8,25.4 | v21.1,25.5 21.1,26.2 T1.P$6
  Bottom 0.3: 9,25.4 8.1,25 8.6,24.5 9,25.4
N$5
  Bottom 0.15: IC3.10 44.4,23.3 44.4,23.9 47.6,27.1 52,27.1 54,29.1 54,32.3 57,35.3 R3.2 57.4,35.9 60.2,35.9 60.3,36 P3.P$5
N$6
  Bottom 0.15: P3.P$4 57.5,28.8 R4.2 53.3,24.6 46.5,24.6 45.2,23.3 IC3.11
N$7
  Bottom 0.15: IC3.12 47,21.5 48.4,22.9 56.1,22.9 57.4,21.6 R5.2 P3.P$3
N$8
  Bottom 0.15: P3.P$2 60.3,14.4 60.2,14.3 57.5,14.3 R6.2 51.8,20 48.2,20 47.6,20.6 47,20.6 IC3.13
N$9
  Bottom 0.15: IC3.14 47,19.9 47.8,19.9 53,14.7 53,13.6 57.4,9.2 R7.2 57.4,7.2 P3.P$1
N$10  (via drill 0.3)
  Top 0.15: 23.5,20.95 23.5,17.4 28.68,12.22 | 23.5,20.95 v23.5,21.4 | v29,11.9 28.68,12.22 | 23.5,20.95 23.7,21.29 v23.5,21.4 | 23.5,20.95 23.3,21.29 v23.5,21.4 | 28.68,12.22 28.78,11.84 v29,11.9 | 28.68,12.22 29.06,12.12 v29,11.9
  Bottom 0.15: T1.P$1 21.5,23.9 21,23.9 21,22.4 21.5,21.9 23,21.9 23.18,21.72 | v23.5,21.4 23.18,21.72 | v29,11.9 29.45,11.9 | 29.45,11.9 31,11.9 32,10.9 R76.1 | 23.18,21.72 23.28,21.34 v23.5,21.4 | 23.18,21.72 23.56,21.62 v23.5,21.4 | 29.45,11.9 29.11,12.1 v29,11.9 | 29.45,11.9 29.11,11.71 v29,11.9
N$13  (via drill 0.3)
  Top 0.15: v54.8,21.6 54.8,22.05 | 54.8,22.05 54.8,28.15 | 54.8,28.15 v54.8,28.6 | v54.8,14.3 54.8,14.75 | 54.8,14.75 54.8,21.15 | 54.8,21.15 v54.8,21.6 | 54.8,7.74 54.8,7.3 v54.7,7.3 | 54.8,7.74 54.8,13.85 | 54.8,13.85 v54.8,14.3 | v54.8,14.3 54.35,14.3 | 54.35,14.3 51.7,14.3 48.52,17.48 | 48.52,17.48 v48.2,17.8 | 54.8,28.15 54.99,28.49 v54.8,28.6 | 54.8,28.15 54.6,28.49 v54.8,28.6 | 54.8,22.05 54.6,21.71 v54.8,21.6 | 54.8,22.05 54.99,21.71 v54.8,21.6 | 54.8,21.15 54.99,21.49 v54.8,21.6 | 54.8,21.15 54.6,21.49 v54.8,21.6 | 54.8,14.75 54.6,14.41 v54.8,14.3 | 54.8,14.75 54.99,14.41 v54.8,14.3 | 54.8,13.85 54.99,14.19 v54.8,14.3 | 54.8,13.85 54.6,14.19 v54.8,14.3 | 54.35,14.3 54.69,14.11 v54.8,14.3 | 54.35,14.3 54.69,14.49 v54.8,14.3 | 54.8,7.74 54.53,7.45 v54.7,7.3 | 54.8,7.74 54.91,7.37 v54.7,7.3 | 48.52,17.48 48.42,17.86 v48.2,17.8 | 48.52,17.48 48.14,17.58 v48.2,17.8
  Bottom 0.15: 47.05,17.55 47,17.5 IC3.17 47.1,17.6 47.8,17.6 | R3.1 56.1,32.9 56.1,29.1 R4.1 55.6,28.6 55.25,28.6 | v54.8,28.6 55.25,28.6 | v54.8,21.6 55.25,21.6 | 55.25,21.6 R5.1 | v54.8,14.3 55.25,14.3 | 55.25,14.3 55.7,14.3 R6.1 | 55.15,7.3 55.7,7.3 R7.1 | 55.15,7.3 v54.7,7.3 | v48.2,17.8 48.1,17.9 47.8,17.6 | 55.25,28.6 54.91,28.8 v54.8,28.6 | 55.25,28.6 54.91,28.41 v54.8,28.6 | 55.25,21.6 54.91,21.8 v54.8,21.6 | 55.25,21.6 54.91,21.41 v54.8,21.6 | 55.25,14.3 54.91,14.49 v54.8,14.3 | 55.25,14.3 54.91,14.11 v54.8,14.3 | 55.15,7.3 54.81,7.5 v54.7,7.3 | 55.15,7.3 54.81,7.11 v54.7,7.3 | 47.8,17.6 48.19,17.57 v48.2,17.8 | 47.8,17.6 48.01,17.92 v48.2,17.8
N$14  (via drill 0.3)
  Top 0.15: v21.4,7.6 21.85,7.6 | 21.85,7.6 40.55,7.6 | 40.55,7.6 v41,7.6 | 21.85,7.6 21.51,7.79 v21.4,7.6 | 21.85,7.6 21.51,7.41 v21.4,7.6 | 40.55,7.6 40.89,7.41 v41,7.6 | 40.55,7.6 40.89,7.7 v41,7.6
  Bottom 0.15: U$1.2 17.7,7.4 17.9,7.6 20.95,7.6 | 20.95,7.6 v21.4,7.6 | v41,7.6 41.32,7.92 | 41.32,7.92 44.3,10.9 44.3,11.6 IC3.24 | 20.95,7.6 21.29,7.41 v21.4,7.6 | 20.95,7.6 21.29,7.79 v21.4,7.6 | 41.32,7.92 40.94,7.82 v41,7.6 | 41.32,7.92 41.22,7.54 v41,7.6
N$15
  Bottom 0.15: 52,34 52,34.2 IC1.1 52,34 | R10.2 52,34 | 52,34 54.5,36.5 R11.1
N$16
  Bottom 0.15: 39.6,33.7 39.9,33.4 R12.2 | 39.6,33.7 41.7,35.8 R13.1 | 39.6,33.7 IC2.1
N$17
  Bottom 0.15: 18.1,29.6 18.1,30 U$2.P$2 | 18.1,29.6 18.1,28.7 19.5,27.3 T1.P$4 | 18.1,29.6 U$2.P$1
N$18  (via drill 0.3)
  Top 0.15: 19.25,24.75 19.05,24.75 v18.85,24.95 | 19.25,24.75 22.2,24.75 22.25,24.8 27.1,24.8 27.3,25 27.5,25 28,25.5 28,25.7 28.38,26.08 | 28.38,26.08 v28.7,26.4 | 19.25,24.75 19.04,25.07 v18.85,24.95 | 19.25,24.75 18.86,24.73 v18.85,24.95 | 28.38,26.08 28.76,26.18 v28.7,26.4 | 28.38,26.08 28.48,26.46 v28.7,26.4
  Bottom 0.15: v18.85,24.95 18.85,24.75 19.05,24.55 | 19.05,24.55 T1.P$3 | v28.7,26.4 29.15,26.4 | 29.15,26.4 38.6,26.4 41.15,23.85 41.15,23.3 IC3.6 | 18.65,25.35 17.9,26.1 R16.2 | 18.65,25.35 18.8,25.2 18.8,25 v18.85,24.95 | 19.05,24.55 19.07,24.94 v18.85,24.95 | 19.05,24.55 18.73,24.76 v18.85,24.95 | 18.65,25.35 18.62,24.96 v18.85,24.95 | 18.65,25.35 18.97,25.14 v18.85,24.95 | 29.15,26.4 28.81,26.59 v28.7,26.4 | 29.15,26.4 28.81,26.2 v28.7,26.4
N$19
  Bottom 0.15: U$2.P$24 13.1,29.45 13.1,23.15 R14.2
N$20
  Bottom 0.15: R15.2 12.05,22.25 12.8,23 12.8,29.25 12.65,29.4 12.65,29.8 12.85,30 U$2.P$23
N$84  (via drill 0.3)
  Top 0.2: v12.9,18 13.2,18 14.2,17 14.3,17.1 14.7,17.1 16,18.4 v16.3,18.4
  Bottom 0.2: SV4.5 8.1,21.9 8.6,21.4 9.1,21.4 9.2,21.4 12.6,18 v12.9,18 | v16.3,18.4 17.9,18.4 21.5,14.8 24.4,14.8 D6.A
  Bottom 0.3: 9.1,21.4 8.4,22.3 8.7,21.5 8.3,21.4
PDI_CLK  (via drill 0.3)
  Top 0.15: v32.2,16.7 32.52,16.38 | 32.52,16.38 33.78,15.12 | 33.78,15.12 v34.1,14.8 | 32.52,16.38 32.42,16.76 v32.2,16.7 | 32.52,16.38 32.14,16.48 v32.2,16.7 | 33.78,15.12 33.88,14.74 v34.1,14.8 | 33.78,15.12 34.16,15.02 v34.1,14.8
  Bottom 0.15: 31.75,16.7 TP2.TP | 31.75,16.7 v32.2,16.7 | v34.1,14.8 34.3,14.8 34.5,14.6 | 34.5,14.6 34.8,14.3 35.3,14.3 IC3.35 | 31.75,16.7 32.09,16.5 v32.2,16.7 | 31.75,16.7 32.09,16.89 v32.2,16.7 | 34.5,14.6 34.29,14.92 v34.1,14.8 | 34.5,14.6 34.11,14.57 v34.1,14.8
PDI_DATA  (via drill 0.3)
  Top 0.15: v29.8,17.3 30.25,17.3 | 30.25,17.3 30.8,17.3 33.78,14.32 | 33.78,14.32 v34.1,14 | 30.25,17.3 29.91,17.5 v29.8,17.3 | 30.25,17.3 29.91,17.11 v29.8,17.3 | 33.78,14.32 33.88,13.94 v34.1,14 | 33.78,14.32 34.16,14.22 v34.1,14
  Bottom 0.15: 29.48,17.62 27.9,19.2 TP1.TP | 29.48,17.62 v29.8,17.3 | v34.1,14 34.3,14 34.5,13.8 | 34.5,13.8 34.8,13.5 35.3,13.5 IC3.34 | 29.48,17.62 29.58,17.24 v29.8,17.3 | 29.48,17.62 29.86,17.52 v29.8,17.3 | 34.5,13.8 34.29,14.12 v34.1,14 | 34.5,13.8 34.11,13.78 v34.1,14
SCK  (via drill 0.3)
  Top 0.15: v31.2,10.6 31.65,10.6 | 31.65,10.6 39,10.6 40.98,12.58 | 40.98,12.58 v41.3,12.9 | 31.65,10.6 31.31,10.79 v31.2,10.6 | 31.65,10.6 31.31,10.4 v31.2,10.6 | 40.98,12.58 41.36,12.68 v41.3,12.9 | 40.98,12.58 41.08,12.96 v41.3,12.9
  Bottom 0.15: U$1.5 17.7,10.6 30.75,10.6 | 30.75,10.6 v31.2,10.6 | v41.3,12.9 41.62,12.58 | 41.62,12.58 41.9,12.3 41.9,11.7 IC3.27 | 30.75,10.6 31.09,10.4 v31.2,10.6 | 30.75,10.6 31.09,10.79 v31.2,10.6 | 41.62,12.58 41.52,12.96 v41.3,12.9 | 41.62,12.58 41.34,12.78 v41.3,12.9
SCL  (via drill 0.3)
  Top 0.15: AUX1.2 45.7,5.7 44.82,6.58 42.8,8.6 42.8,9.3 42.2,9.9 42.2,9.95 | v42.2,10.4 42.2,9.95 | 42.2,9.95 42.4,10.29 v42.2,10.4 | 42.2,9.95 42.01,10.29 v42.2,10.4
  Top 0.3: 44.82,6.58 45.2,5.51 AUX1.2 45.9,6.23 44.82,6.58
  Bottom 0.15: v42.2,10.4 42.2,10.1 42.07,9.97 | 42.07,9.97 41.7,9.6 41.2,9.6 40.4,10.4 40.4,11.6 IC3.29 | 42.07,9.97 42.35,10.24 v42.2,10.4 | 42.07,9.97 41.98,10.35 v42.2,10.4
SDA  (via drill 0.3)
  Top 0.15: AUX1.1 43.1,5.7 42.5,6.3 42.5,9.1 41.72,9.88 | 41.72,9.88 v41.4,10.2 | 41.72,9.88 41.62,10.26 v41.4,10.2 | 41.72,9.88 41.34,9.98 v41.4,10.2
  Bottom 0.15: v41.4,10.2 41.4,10.65 | 41.4,10.65 41.4,11.4 41.2,11.6 IC3.28 | 41.4,10.65 41.2,10.31 v41.4,10.2 | 41.4,10.65 41.59,10.31 v41.4,10.2
SERIAL_RX
  Bottom 0.15: R1.2 33.95,9.5 36.35,9.5 37.85,11 37.85,11.6 IC3.32
SERIAL_RX_R  (via drill 0.3)
  Top 0.15: v19,13.3 19,13.2 18.7,12.9 18.7,12.8 18.6,12.7 v21.6,9.7
  Bottom 0.15: SV4.4 5.5,24.5 6.3,23.7 6.4,23.6 7.7,23.6 9.2,22.1 9.2,21.9 11.9,19.2 14.7,19.2 19,14.9 v19,13.3 | v21.6,9.7 26.4,9.7 26.8,9.3 32,9.3 32.1,9.4 R1.1 32.1,9.3 32.1,7.9 R77.1
  Bottom 0.3: 6.3,23.7 5.5,24.1 5.9,24.5 6.3,23.7
SERIAL_TX
  Bottom 0.15: R76.2 34.1,11.15 36.65,11.15 37.1,11.6 IC3.33
TE  (via drill 0.3)
  Top 0.15: 30.05,31.5 30,31.55 v30,31.95 | 30.05,31.5 35.67,25.88 | 35.67,25.88 35.8,25.75 v36.1,25.75 | 24.2,30.5 23.9,30.5 23.65,30.75 22.4,30.75 22.15,30.5 21.45,30.5 20.75,31.2 15.4,31.2 13.25,33.35 13.25,34.1 | 24.2,30.5 v24.65,30.5 | v13.25,34.55 13.25,34.1 | 35.67,25.88 35.94,25.6 v36.1,25.75 | 35.67,25.88 36.05,25.97 v36.1,25.75 | 30.05,31.5 30.21,31.86 v30,31.95 | 30.05,31.5 29.82,31.82 v30,31.95 | 24.2,30.5 24.64,30.5 v24.65,30.5 | 24.2,30.5 24.54,30.7 v24.65,30.5 | 13.25,34.1 13.45,34.44 v13.25,34.55 | 13.25,34.1 13.05,34.44 v13.25,34.55
  Bottom 0.15: v36.1,25.75 36.35,25.5 36.47,25.5 | 36.47,25.5 37.55,25.5 38.75,24.3 39.1,24.3 39.55,23.85 39.55,23.3 IC3.4 | v30,31.95 30,31.65 29.87,31.52 | 29.87,31.52 28.9,30.55 27.9,30.55 27.65,30.8 24.98,30.8 | 24.98,30.8 24.95,30.8 v24.65,30.5 | U$2.P$13 13.25,34.1 | 13.25,34.1 v13.25,34.55 | 36.47,25.5 36.3,25.85 v36.1,25.75 | 36.47,25.5 36.09,25.52 v36.1,25.75 | 29.87,31.52 30.15,31.79 v30,31.95 | 29.87,31.52 29.78,31.9 v30,31.95 | 24.98,30.8 24.6,30.72 v24.65,30.5 | 24.98,30.8 24.86,30.43 v24.65,30.5 | 13.25,34.1 13.45,34.44 v13.25,34.55 | 13.25,34.1 13.05,34.44 v13.25,34.55
VCCIO  (via drill 0.3)
  Top 0.3: v45.45,28.1 45.77,28.42 | 45.77,28.42 46.63,29.28 | 46.63,29.28 v46.95,29.6 | 38.1,15.45 38.1,14.2 | 38.1,14.2 v38.1,13.75 | v37.75,15.8 38.07,15.48 | 38.07,15.48 38.1,15.45 | 38.1,15.45 38.3,15.65 44.05,15.65 44.7,16.3 | 44.7,16.3 45.3,16.3 | 45.3,16.3 v45.75,16.3 | v43.5,21.2 43.65,21.2 | 43.65,21.2 | 44.7,16.3 43.65,17.35 43.65,20.78 | v19.65,28.85 19.85,28.85 20.05,28.65 | 20.05,28.65 20.4,28.3 22.25,28.3 23.05,27.5 23.55,27.5 23.75,27.7 24.95,27.7 25.89,26.76 | 25.89,26.76 26.15,26.5 v26.15,26.4 | AUX1.3 48.3,5.7 48.3,6.97 | 48.3,12.86 48.3,13.2 v48.2,13.3 | 48.3,12.86 48.3,6.97 | 45.77,28.42 45.38,28.23 v45.45,28.1 | 45.77,28.42 45.59,28.04 v45.45,28.1 | 46.63,29.28 47.02,29.46 v46.95,29.6 | 46.63,29.28 46.81,29.66 v46.95,29.6 | 38.1,14.2 37.96,13.8 v38.1,13.75 | 38.1,14.2 38.24,13.8 v38.1,13.75 | 38.07,15.48 37.88,15.87 v37.75,15.8 | 38.07,15.48 37.69,15.66 v37.75,15.8 | 45.3,16.3 45.7,16.16 v45.75,16.3 | 45.3,16.3 45.7,16.34 v45.75,16.3 | 43.65,20.78 43.65,21.2 | 43.65,21.2 v43.5,21.2 | 43.65,20.78 43.38,21.11 v43.5,21.2 | 20.05,28.65 19.76,28.95 v19.65,28.85 | 20.05,28.65 19.63,28.7 v19.65,28.85 | 25.89,26.76 26.01,26.36 v26.15,26.4 | 25.89,26.76 26.23,26.52 v26.15,26.4 | 48.3,12.86 48.35,13.28 v48.2,13.3 | 48.3,12.86 48.07,13.22 v48.2,13.3 | 48.3,6.97 47.77,5.96 AUX1.3 | 48.3,6.97 48.78,5.93 AUX1.3
  Bottom 0.3: C18.2 45,39.8 49,39.8 IC1.4 49.8,40.4 51.1,39.1 | 51.1,39.1 51.9,38.3 54.5,38.3 R11.2 | 51.1,39.1 51,39 51,33.3 49.4,31.7 49.4,30.8 C20.+ 49.4,30.7 48.35,29.65 47.4,29.65 | 45,28.1 43,26.1 C26.2 42.9,26.1 42.9,24.6 43.5,24 43.5,23.3 IC3.9 43.5,23.15 43.35,23 43.35,21.65 | 45,28.1 v45.45,28.1 | v46.95,29.6 47.15,29.6 47.2,29.65 47.4,29.65 | v38.1,13.75 38.3,13.75 38.5,13.55 | 38.5,13.55 39.05,13 39.05,12.6 38.85,12.4 38.85,11.8 IC3.31 38.7,11.6 38.7,10.9 38.3,10.5 38.3,9.2 C24.2 | v37.75,15.8 37.55,15.8 37.35,16 | 37.35,16 36.45,16.9 36.45,17.05 36.1,17.4 35.5,17.4 IC3.39 35.3,17.5 34.7,17.5 33.7,18.5 33.3,18.5 C23.2 33.1,18.6 32.2,18.6 29.1,21.7 29,21.7 TP3.TP 27.8,21.9 26.3,23.4 26.3,25.98 | v45.75,16.3 45.9,16.3 46.13,16.07 | 46.13,16.07 46.25,15.95 46.85,15.95 IC3.19 47.1,15.85 48.2,15.85 48.38,15.68 | v43.5,21.2 43.35,21.65 | 43.35,21.65 43.35,21.62 | 48.38,15.68 49,15.05 49.1,15.1 C25.2 48.9,15 48.2,14.3 48.2,13.75 | 48.38,15.68 48.3,15.6 | v26.15,26.4 26.25,26.4 26.3,26.35 | 26.3,25.98 26.3,26.35 | 19.33,29.17 19.25,29.25 19.25,30.35 19.2,30.4 U$2.P$3 | 19.33,29.17 v19.65,28.85 | 48.2,13.75 v48.2,13.3 | 45,28.1 45.4,27.96 v45.45,28.1 | 45,28.1 45.4,28.24 v45.45,28.1 | 47.4,29.65 46.98,29.75 v46.95,29.6 | 47.4,29.65 46.91,29.66 v46.95,29.6 | 38.5,13.55 38.21,13.85 v38.1,13.75 | 38.5,13.55 38.08,13.6 v38.1,13.75 | 37.35,16 37.64,15.7 v37.75,15.8 | 37.35,16 37.77,15.95 v37.75,15.8 | 46.13,16.07 45.87,16.39 v45.75,16.3 | 46.13,16.07 45.72,16.15 v45.75,16.3 | 43.35,21.62 43.45,21.3 v43.5,21.2 | 43.35,21.62 43.62,21.29 v43.5,21.2 | 19.33,29.17 19.52,28.79 v19.65,28.85 | 19.33,29.17 19.71,28.98 v19.65,28.85
  Bottom 0.3: 26.3,26.35 26.3,26.4 v26.15,26.4 | 26.3,25.98 26.03,26.31 v26.15,26.4 | 48.2,13.75 48.06,13.35 v48.2,13.3 | 48.2,13.75 48.34,13.35 v48.2,13.3
  pour Bottom (no thermals): 43,42.9 57,42.9 57,36.4 43,36.4
VDD  (via drill 0.3)
  Top 0.3: 12.2,22.75 12.2,19.7 13.1,18.8 | 12.2,22.75 v12.2,23.2 | 13.1,18.8 13.3,18.6 v13.5,18.6 | 23.95,39.9 6.6,39.9 2.4,35.7 2.4,19.7 6.2,19.7 6.8,19.1 6.9,19.1 8.1,17.9 9.6,17.9 10.6,16.9 | 23.95,39.9 v24.4,39.9 | v24.4,39.9 24.65,39.9 | 24.65,39.9 24.85,39.9 | 24.85,39.9 v25.1,39.9 | v12.2,26.4 12.65,26.4 | 12.65,26.4 13.25,26.4 | 13.25,26.4 v13.7,26.4 | 12.2,22.75 12.34,23.15 v12.2,23.2 | 12.2,22.75 12.06,23.15 v12.2,23.2 | 13.1,18.8 13.39,18.5 v13.5,18.6 | 13.1,18.8 13.52,18.75 v13.5,18.6 | 23.95,39.9 24.35,39.76 v24.4,39.9 | 23.95,39.9 24.35,40.04 v24.4,39.9 | 24.85,39.9 24.45,40.04 v24.4,39.9 | 24.85,39.9 24.45,39.76 v24.4,39.9 | 24.65,39.9 25.05,39.76 v25.1,39.9 | 24.65,39.9 25.05,40.04 v25.1,39.9 | 13.25,26.4 13.65,26.26 v13.7,26.4 | 13.25,26.4 13.65,26.54 v13.7,26.4 | 12.65,26.4 12.25,26.54 v12.2,26.4 | 12.65,26.4 12.25,26.26 v12.2,26.4 | 10.6,16.9 v11,16.5 v11.7,16.5 | 10.6,16.9 11.7,16.6
  Bottom 0.2: 12.4,28.7 12.4,29.1 12.3,29.2 12.3,30 12.7,30.4 U$2.P$22
  Bottom 0.3: R13.2 39.8,37.5 IC2.4 37.9,39.2 33.1,39.2 C2.2 | 20.1,9.8 C3.2 20,9.7 17.8,9.7 U$1.4 17.6,9.7 17.1,9.7 13.5,13.3 13.5,16.5 | 13.5,16.5 13.5,18.15 | 13.5,18.15 v13.5,18.6 | 12,23.6 12.2,23.4 v12.2,23.2 | 11.99,23.6 12,23.6 | 11.99,23.6 11.7,23.6 11.4,23.9 10.4,23.9 R8.2 10.3,23.8 | v24.4,39.9 24.42,40.35 | 24.42,40.35 24.5,42.65 | 12.4,28.7 12.4,27.5 12.1,27.2 12.1,26.84 | 12.1,25.96 12.1,23.7 12.01,23.61 | 12.1,25.96 12.1,26.4 | 12.1,26.4 12.1,26.84 | 12.01,23.61 12,23.6 | 12.1,26.4 v12.2,26.4 | v13.7,26.4 13.5,26.2 13.5,26 | 13.5,26 13.5,25.4 14,24.9 14,24.7 14.6,24.1 R2.1 | 11.99,23.6 12.05,23.18 v12.2,23.2 | 11.99,23.6 12.3,23.31 v12.2,23.2 | 12.01,23.61 12.05,23.18 v12.2,23.2 | 12.01,23.61 12.31,23.31 v12.2,23.2 | 13.5,18.15 13.64,18.55 v13.5,18.6 | 13.5,18.15 13.36,18.55 v13.5,18.6 | 24.42,40.35 24.26,39.95 v24.4,39.9 | 24.42,40.35 24.54,39.95 v24.4,39.9 | 13.5,26 13.8,26.29 v13.7,26.4 | 13.5,26 13.55,26.42 v13.7,26.4 | 12.1,25.96 12.33,26.32 v12.2,26.4 | 12.1,25.96 12.05,26.38 v12.2,26.4 | 12.1,26.84 12.05,26.42 v12.2,26.4 | 12.1,26.84 12.33,26.48 v12.2,26.4 | 12.3,16.5 13.5,16.5 | 12.2,16.5 12.3,16.5 | 12.2,16.5 v11,16.5 11,16.3 11.7,16.3 12.2,16.5 | 12.3,16.5 11.7,16.6 11,16.6
  pour Bottom (no thermals): 24.5,42.9 42.5,42.9 42.5,36.9 24.5,36.9
~CS  (via drill 0.3)
  Top 0.15: v27.35,32.6 27.57,32.82 | 27.57,32.82 27.95,33.2 28.25,33.2 28.55,32.9 30.35,32.9 30.95,32.3 30.95,31.55 35.9,26.6 36.5,26.6 37.1,26 37.1,25.1 37.4,24.8 37.4,23.75 38.6,22.55 39.2,22.55 39.65,22.1 39.65,21.05 42.8,17.9 42.8,17 42.37,16.57 | 42.37,16.57 v42.05,16.25 | 27.57,32.82 27.29,32.82 v27.35,32.6 | 27.57,32.82 27.57,32.54 v27.35,32.6 | 42.37,16.57 41.99,16.47 v42.05,16.25 | 42.37,16.57 42.27,16.19 v42.05,16.25
  Bottom 0.15: U$2.P$11 18.05,33.65 18.5,33.65 18.8,33.35 19.7,33.35 19.85,33.5 21.95,33.5 22.25,33.8 23.15,33.8 24.95,32 27.05,32 27.12,32.17 | 27.12,32.17 27.35,32.3 v27.35,32.6 | v42.05,16.25 42.2,16.4 42.48,16.12 | 42.48,16.12 44.6,14 45.8,14 46.25,13.55 46.85,13.55 IC3.22 | 27.12,32.17 27.5,32.44 v27.35,32.6 | 27.12,32.17 27.13,32.55 v27.35,32.6 | 42.48,16.12 42.21,16.4 v42.05,16.25 | 42.48,16.12 42.1,16.03 v42.05,16.25
~RD  (via drill 0.3)
  Top 0.15: v11.3,30.1 11.25,30.1 11.25,30.15 11.56,30.46 | 11.56,30.46 11.7,30.6 13.3,30.6 14.5,29.4 19.85,29.4 20.55,28.7 23.45,28.7 23.75,28.4 25.25,28.4 25.55,28.1 26.75,28.1 26.8,28.15 28,28.15 28.15,28 28.15,27.95 | 28.15,27.95 v28.15,27.5 | v34.15,19.8 34.15,19.45 34.2,19.4 34.36,19.4 | 34.36,19.4 36.15,19.4 36.4,19.65 40.1,19.65 41.45,18.3 41.45,18.1 | 41.45,18.1 v41.45,17.65 | 11.56,30.46 11.21,30.3 v11.3,30.1 | 11.56,30.46 11.52,30.08 v11.3,30.1 | 28.15,27.95 27.95,27.61 v28.15,27.5 | 28.15,27.95 28.34,27.61 v28.15,27.5 | 34.36,19.4 34.38,19.79 v34.15,19.8 | 34.36,19.4 34.03,19.61 v34.15,19.8 | 41.45,18.1 41.26,17.76 v41.45,17.65 | 41.45,18.1 41.65,17.76 v41.45,17.65
  Bottom 0.15: v28.15,27.5 28.15,27.05 | 28.15,27.05 28.15,26.8 28.1,26.8 28.1,26.2 29.2,25.1 29.15,25.1 29.15,22.4 29.45,22.4 32.15,19.7 33.71,19.7 | 33.71,19.7 34.05,19.7 v34.15,19.8 | v41.45,17.65 41.77,17.33 | 41.77,17.33 44.8,14.3 46.95,14.3 IC3.21 | U$2.P$20 12,31.2 11.9,31.1 11.9,30.8 11.52,30.42 | v11.3,30.1 11.52,30.42 | 11.52,30.42 11.24,30.32 v11.3,30.1 | 11.52,30.42 11.52,30.04 v11.3,30.1 | 28.15,27.05 28.34,27.39 v28.15,27.5 | 28.15,27.05 27.95,27.39 v28.15,27.5 | 33.71,19.7 34.08,19.7 v34.15,19.8 | 33.71,19.7 34,19.96 v34.15,19.8 | 41.77,17.33 41.57,17.71 v41.45,17.65 | 41.77,17.33 41.39,17.43 v41.45,17.65
~RST  (via drill 0.3)
  Top 0.15: v27.35,33.35 27.5,33.2 27.78,33.48 | 27.78,33.48 27.8,33.5 28.4,33.5 28.7,33.2 30.5,33.2 31.25,32.45 31.25,31.7 35.45,27.5 38,27.5 44.15,21.35 44.15,17.45 44.9,16.7 45.35,16.7 45.5,16.85 45.95,16.85 46.4,16.4 46.4,12.95 46.27,12.82 | 46.27,12.82 v45.95,12.5 | 27.78,33.48 27.4,33.57 v27.35,33.35 | 27.78,33.48 27.51,33.2 v27.35,33.35 | 46.27,12.82 45.89,12.72 v45.95,12.5 | 46.27,12.82 46.17,12.44 v45.95,12.5
  Bottom 0.15: U$2.P$12 18.05,33.95 18.65,33.95 18.95,33.65 19.55,33.65 19.7,33.8 21.8,33.8 22.1,34.1 23.3,34.1 25.1,32.3 26.3,32.3 27.03,33.13 | 27.03,33.13 v27.35,33.35 | v45.95,12.5 45.63,12.18 | 45.63,12.18 45.2,11.75 IC3.23 | 27.03,33.13 27.41,33.13 v27.35,33.35 | 27.03,33.13 27.13,33.41 v27.35,33.35 | 45.63,12.18 46.01,12.28 v45.95,12.5 | 45.63,12.18 45.73,12.56 v45.95,12.5
~WR  (via drill 0.3)
  Top 0.15: 42.07,18.13 29.1,31.1 28.45,31.1 | 42.07,18.13 42.2,18 v42.2,17.7 | v28.1,31.1 28.45,31.1 | v21.95,31.05 22.4,31.05 | 22.4,31.05 23.65,31.05 | 23.65,31.05 v24.1,31.05 | 42.07,18.13 41.98,17.75 v42.2,17.7 | 42.07,18.13 42.35,17.86 v42.2,17.7 | 28.45,31.1 28.21,31.3 v28.1,31.1 | 28.45,31.1 28.21,30.91 v28.1,31.1 | 23.65,31.05 24.09,31.05 v24.1,31.05 | 23.65,31.05 23.99,31.25 v24.1,31.05 | 22.4,31.05 22.06,31.25 v21.95,31.05 | 22.4,31.05 21.96,31.05 v21.95,31.05
  Bottom 0.15: v42.2,17.7 42.2,17.35 42.29,17.26 | 42.29,17.26 44.95,14.6 45.95,14.6 46.4,15.05 46.95,15.05 IC3.20 | 24.55,31.1 24.15,31.1 v24.1,31.05 | 24.55,31.1 27.75,31.1 | 27.75,31.1 v28.1,31.1 | v21.95,31.05 21.7,31.3 21.58,31.3 | 21.58,31.3 20.65,31.3 20.55,31.2 U$2.P$5 | 42.29,17.26 42.41,17.63 v42.2,17.7 | 42.29,17.26 42.03,17.55 v42.2,17.7 | 27.75,31.1 27.99,31 v28.1,31.1 | 27.75,31.1 27.99,31.2 v28.1,31.1 | 24.55,31.1 24.19,31.26 v24.1,31.05 | 24.55,31.1 24.23,30.87 v24.1,31.05 | 21.58,31.3 21.75,30.95 v21.95,31.05 | 21.58,31.3 21.96,31.27 v21.95,31.05

### Text on the board
Bottom: huslik-elektronik.de | Üeberloader V0.9